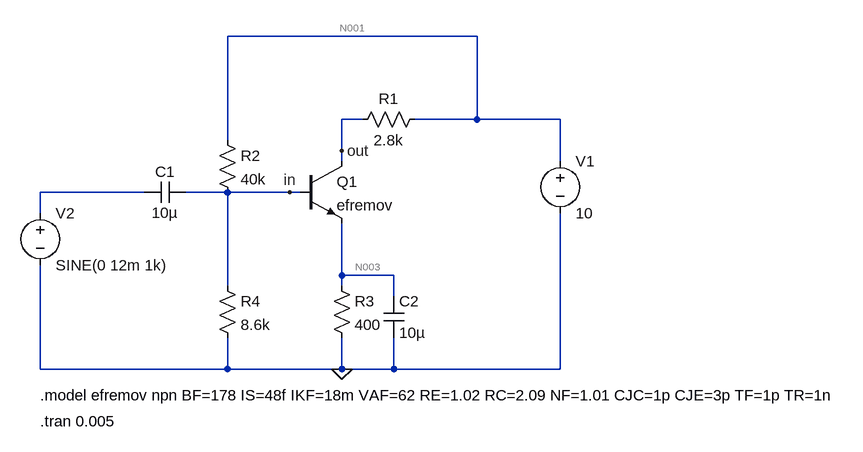
[diagram p0: schematic 3.asc]
3.asc, the LTspice schematic file:
Version 4
SHEET 1 1164 680
WIRE 416 -80 32 -80
WIRE 240 48 208 48
WIRE 416 48 416 -80
WIRE 416 48 320 48
WIRE 544 48 416 48
WIRE 32 80 32 -80
WIRE 208 96 208 48
WIRE 208 112 208 96
WIRE 544 112 544 48
WIRE -96 160 -256 160
WIRE 32 160 -32 160
WIRE 128 160 32 160
WIRE 144 160 128 160
WIRE -256 192 -256 160
WIRE 208 288 208 208
WIRE 288 288 208 288
WIRE 32 304 32 160
WIRE 208 304 208 288
WIRE 288 320 288 288
WIRE -256 432 -256 272
WIRE 32 432 32 384
WIRE 32 432 -256 432
WIRE 208 432 208 384
WIRE 208 432 32 432
WIRE 288 432 288 384
WIRE 288 432 208 432
WIRE 544 432 544 192
WIRE 544 432 288 432
FLAG 208 432 0
FLAG 208 96 out
FLAG 128 160 in
SYMBOL npn 144 112 R0
SYMATTR InstName Q1
SYMATTR Value efremov
SYMBOL voltage 544 96 R0
WINDOW 123 0 0 Left 2
WINDOW 39 0 0 Left 2
SYMATTR InstName V1
SYMATTR Value 10
SYMBOL res 336 32 R90
WINDOW 0 0 56 VBottom 2
WINDOW 3 32 56 VTop 2
SYMATTR InstName R1
SYMATTR Value 2.8k
SYMBOL res 16 64 R0
SYMATTR InstName R2
SYMATTR Value 40k
SYMBOL voltage -256 176 R0
WINDOW 123 0 0 Left 2
WINDOW 39 0 0 Left 2
SYMATTR InstName V2
SYMATTR Value SINE(0 12m 1k)
SYMBOL cap -32 144 R90
WINDOW 0 0 32 VBottom 2
WINDOW 3 32 32 VTop 2
SYMATTR InstName C1
SYMATTR Value 10µ
SYMBOL res 192 288 R0
SYMATTR InstName R3
SYMATTR Value 400
SYMBOL res 16 288 R0
SYMATTR InstName R4
SYMATTR Value 8.6k
SYMBOL cap 272 320 R0
SYMATTR InstName C2
SYMATTR Value 10µ
TEXT -256 472 Left 2 !.model efremov npn BF=178 IS=48f IKF=18m VAF=62 RE=1.02 RC=2.09 NF=1.01 CJC=1p CJE=3p TF=1p TR=1n
TEXT -256 512 Left 2 !.tran 0.005

The netlist it stands for:
* 3.asc
Q1 out in N003 0 efremov
V1 N001 0 10
R1 N001 out 2.8k
R2 N001 in 40k
V2 N002 0 SINE(0 12m 1k)
C1 in N002 10µ
R3 N003 0 400
R4 in 0 8.6k
C2 N003 0 10µ
.model NPN NPN
.model PNP PNP
.lib standard.bjt
.model efremov npn BF=178 IS=48f IKF=18m VAF=62 RE=1.02 RC=2.09 NF=1.01 CJC=1p CJE=3p TF=1p TR=1n
.tran 0.005
.backanno
.end

* Results of the author's LTspice run, read from the files saved beside the schematic
* Operating Point, zero values left out:
*   V(out) = 2.983 V
*   V(in) = 1.659 V
*   V(n003) = 1.009 V
*   V(n001) = 10 V
*   Ic(Q1) = 2.506 mA
*   Ib(Q1) = 15.66 µA
*   Ie(Q1) = -2.522 mA
*   I(R4) = 192.9 µA
*   I(R3) = 2.522 mA
*   I(R2) = 208.5 µA
*   I(R1) = 2.506 mA
*   I(V1) = -2.714 mA
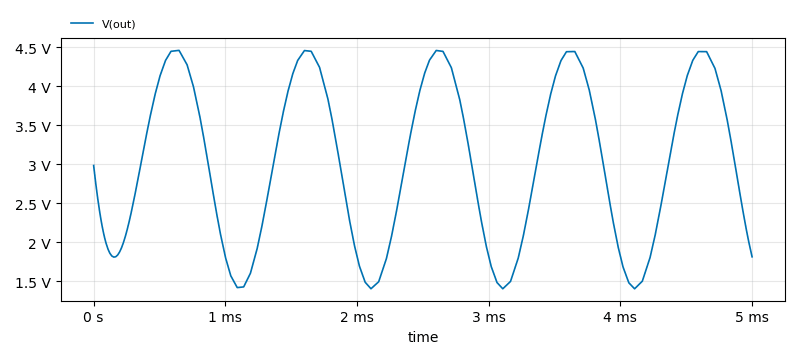
[diagram p1: Transient Analysis of 3.asc, plotted from the saved traces]
* Transient Analysis, 1 run:
*   V(out): min 1.402 V, max 4.461 V, average 3.011 V, rms 3.191 V, last 1.812 V